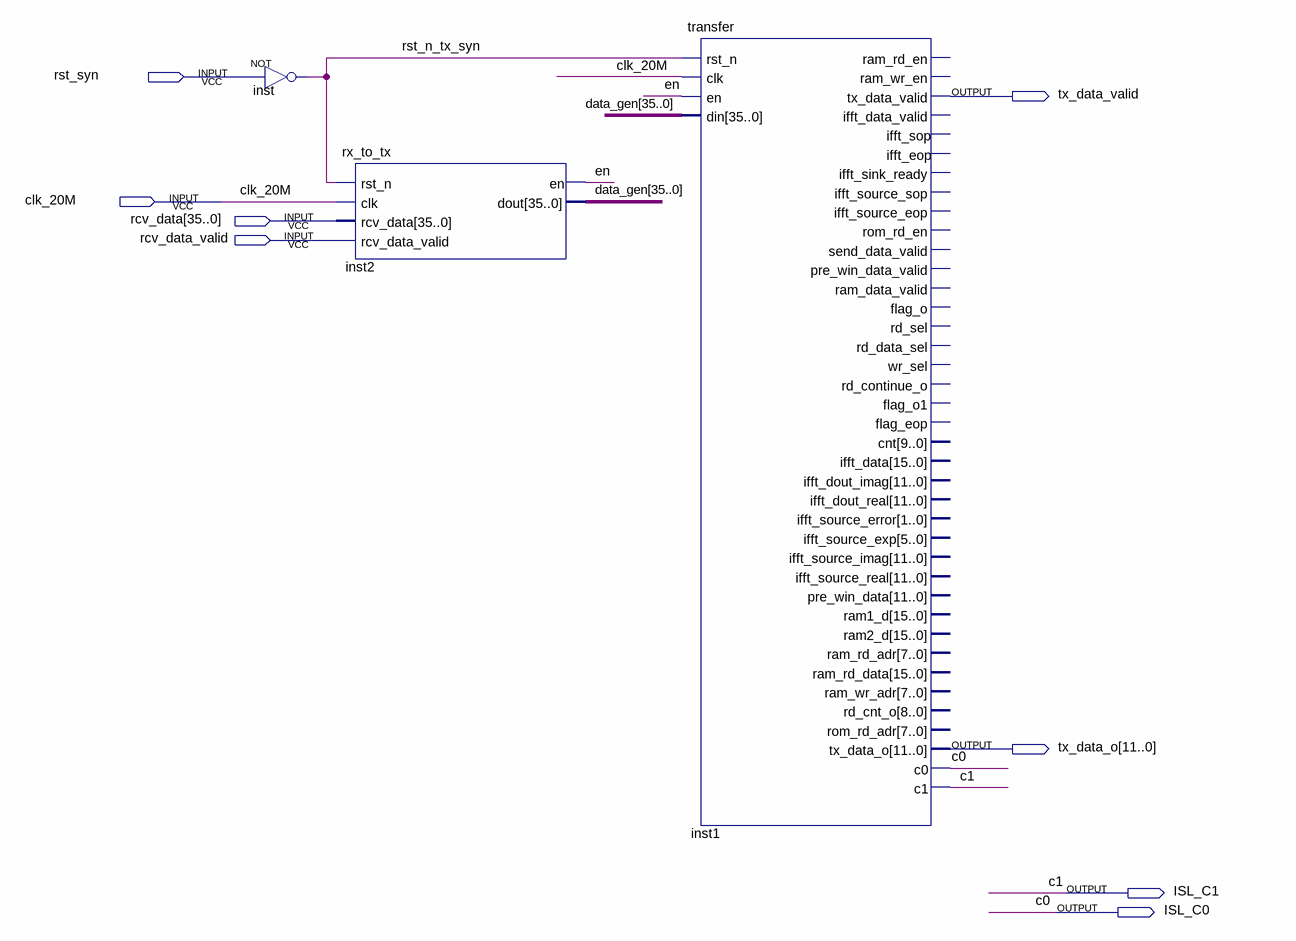
[diagram p0: schematic sheet]
// Quartus schematic tx.bdf as structural Verilog: 3 symbols, 8 pins
module tx (
  input  rst_syn,
  input  clk_20M,
  input  [35:0] rcv_data,
  input  rcv_data_valid,
  output tx_data_valid,
  output [11:0] tx_data_o,
  output ISL_C1,
  output ISL_C0
);

  wire en, rst_n_tx_syn;
  wire [35:0] data_gen;

  not inst (rst_n_tx_syn, rst_syn);
  rx_to_tx inst2 (
    .rst_n(rst_n_tx_syn), .clk(clk_20M), .rcv_data(rcv_data), .rcv_data_valid(rcv_data_valid), .en(en),
    .dout(data_gen));
  transfer inst1 (
    .rst_n(rst_n_tx_syn), .clk(clk_20M), .en(en), .din(data_gen), .tx_data_valid(tx_data_valid),
    .tx_data_o(tx_data_o), .c0(ISL_C0), .c1(ISL_C1));  // open: ram_rd_en, ram_wr_en, ifft_data_valid, ifft_sop, ifft_eop, ifft_sink_ready, ifft_source_sop, ifft_source_eop, rom_rd_en, send_data_valid, pre_win_data_valid, ram_data_valid, flag_o, rd_sel, rd_data_sel, wr_sel, rd_continue_o, flag_o1, flag_eop, cnt, ifft_data, ifft_dout_imag, ifft_dout_real, ifft_source_error, ifft_source_exp, ifft_source_imag, ifft_source_real, pre_win_data, ram1_d, ram2_d, ram_rd_adr, ram_rd_data, ram_wr_adr, rd_cnt_o, rom_rd_adr

  // Other names for the same wires on the sheet: c0 = ISL_C0; c1 = ISL_C1
endmodule
